# Altium project CYUSB3314.PrjPCB
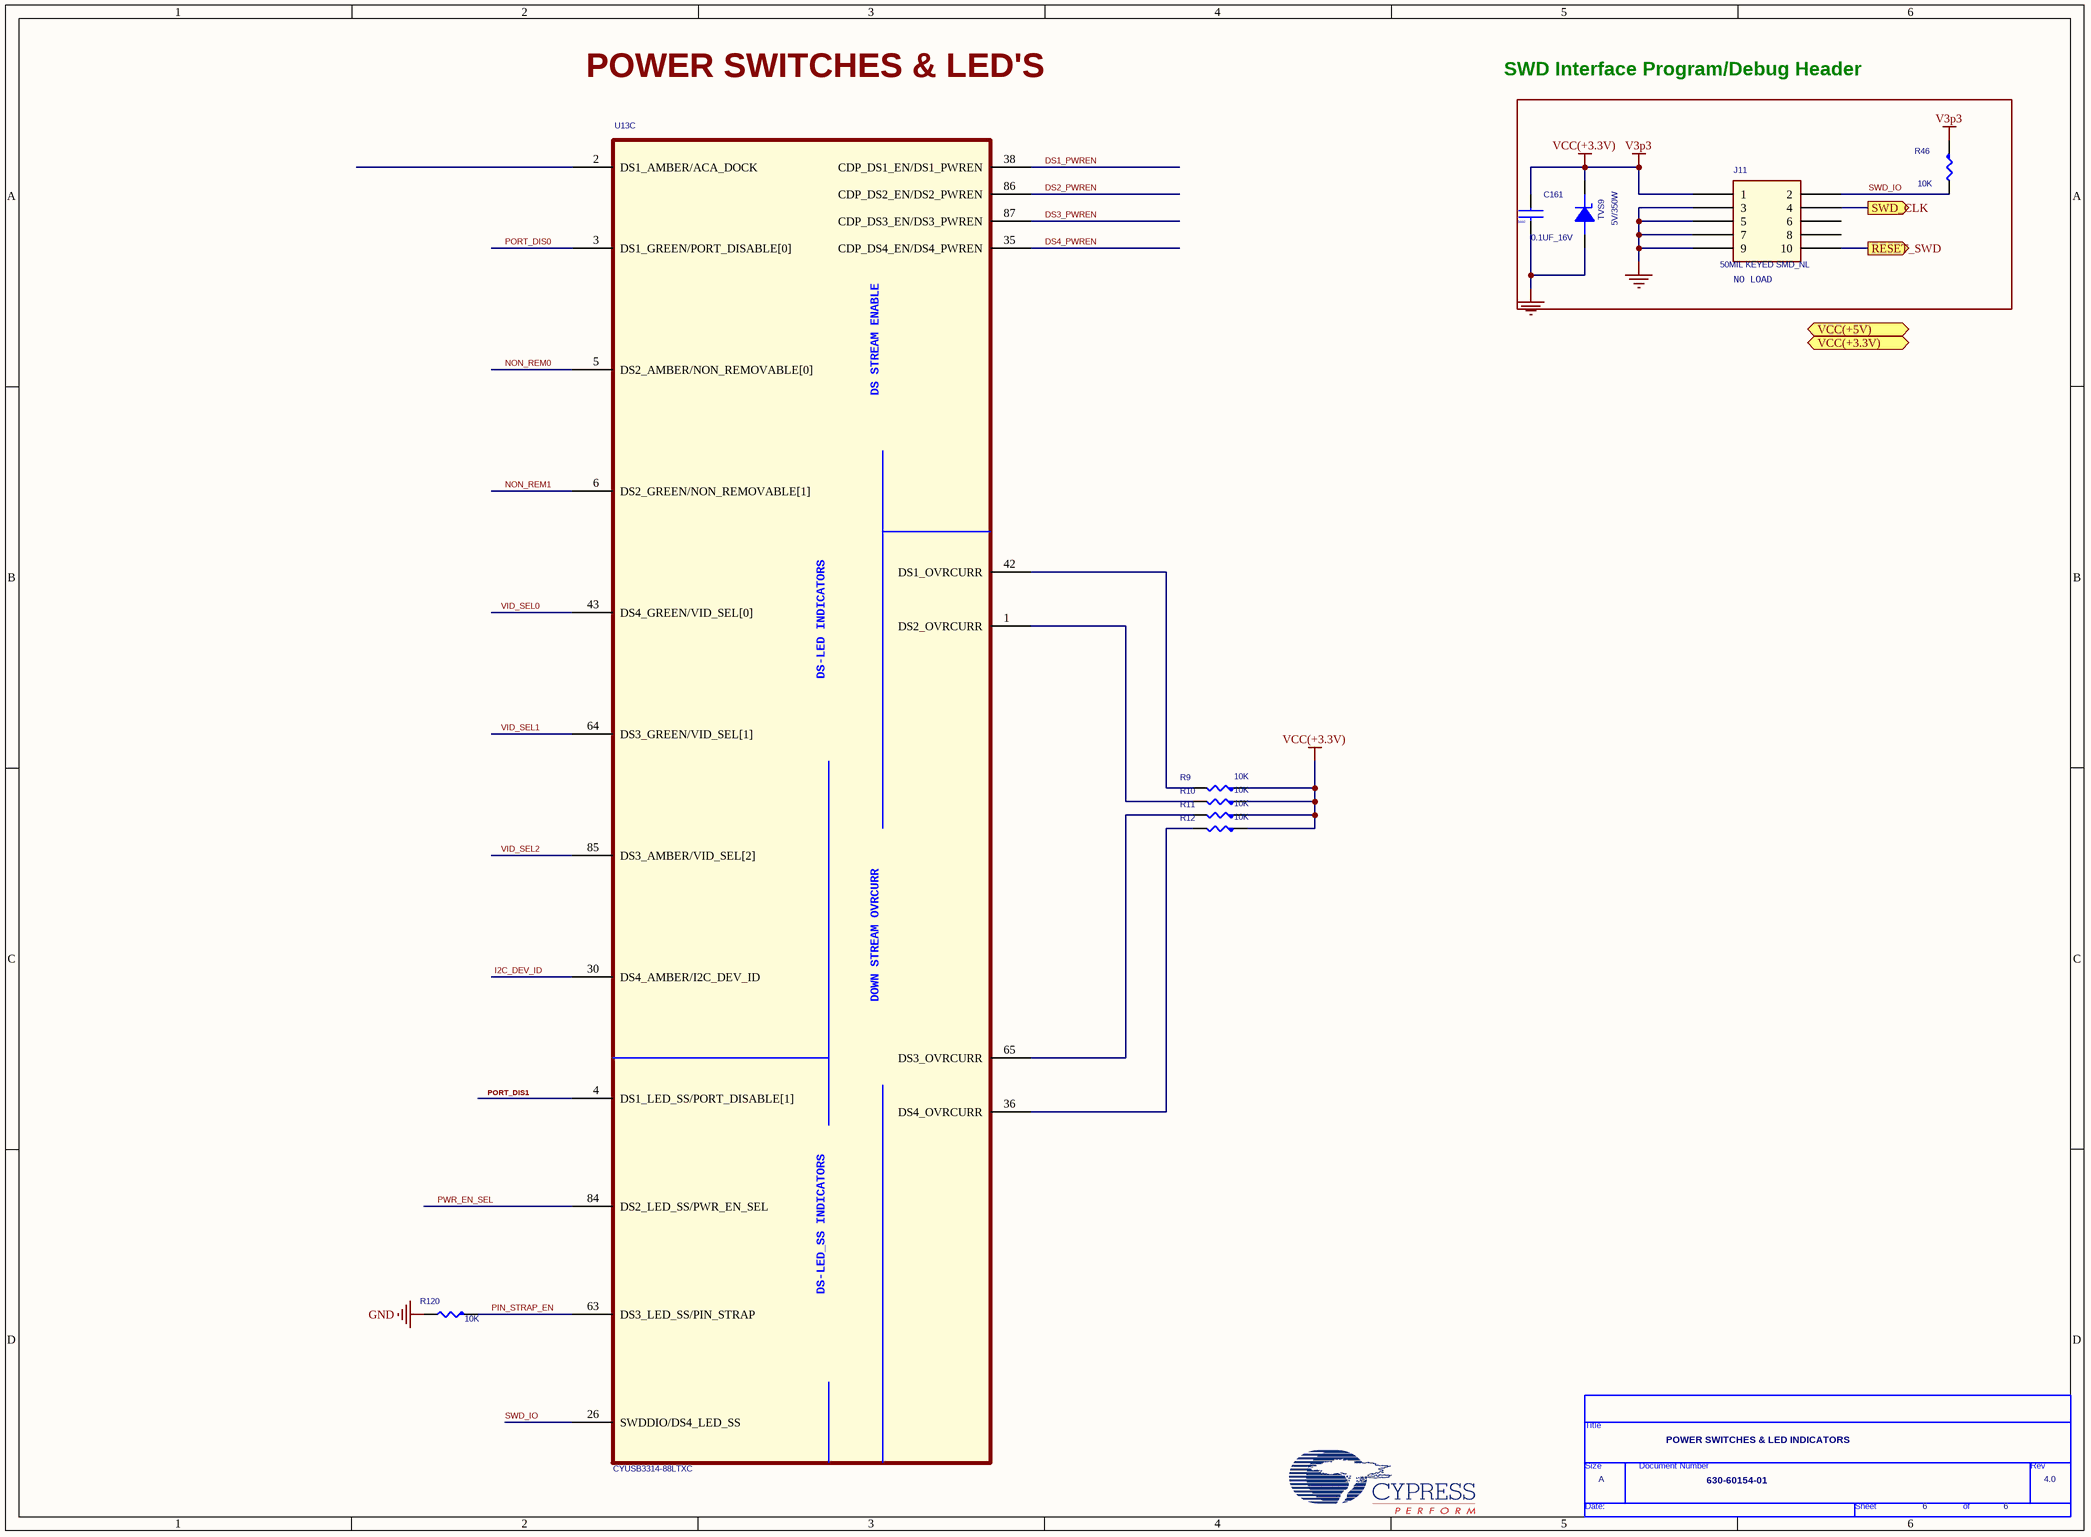
[diagram p0: Cyusb3314_Indicator.SchDoc]
4 sheets, 142 parts. Net scope: global (net labels, ports and power ports of the same name join across sheets).
Board file: CYUSB3314.PcbDoc
Sheets:
  Cyusb3314_Indicator.SchDoc
  Power.SchDoc
  Cyusb3314_Interface.SchDoc
  Cyusb3314_Power.SchDoc

## Sheet Cyusb3314_Indicator.SchDoc
size 391 x 287 mm

### Parts
(Parts that share a designator on the sheet are numbered #1, #2 ... from top to bottom, then left to right.)
*#1  Page Count: 6  Page Size: A  Title: POWER SWITCHES & LED INDICATORS  RevCode: 4.0  Doc: 630-60154-01  (hidden comment: TitleBlock0)  (graphical)
C161  0.1UF_16V  [C0402]
J11  50MIL KEYED SMD_NL  [SAMTEC_FTSH-105-01-L-DV-K]
R9  10K  [0603S-RES]
R10  10K  [0603S-RES]
R11  10K  [0603S-RES]
R12  10K  [0603S-RES]
R46  10K  [0603S-RES]
R120#1  10K  [0603S-RES]
TVS9  5V/350W  [SOD2513X120M]
U13  CYUSB3314-88LTXC  [QFN40P1000X1000X100-89M]  (part C of 3)

### Blocks framed on the sheet
NO LOAD: C161 J11 R46 TVS9

### Ports
RESET_SWD (out), SWD_CLK (out), VCC(+3.3V) (in), VCC(+5V) (in)

### Nets
GND: C161.2 J11.3 J11.5 J11.7 J11.9 R120#1.2 TVS9.2(A)
V3p3: C161.1 J11.1 R9.1 R10.1 R11.1 R12.1 R46.1 TVS9.1(K)  [also labelled VCC(+3.3V)]
DS1_PWREN: U13.38(CDP_DS1_EN/DS1_PWREN)
DS2_PWREN: U13.86(CDP_DS2_EN/DS2_PWREN)
DS3_PWREN: U13.87(CDP_DS3_EN/DS3_PWREN)
DS4_PWREN: U13.35(CDP_DS4_EN/DS4_PWREN)
I2C_DEV_ID: U13.30(DS4_AMBER/I2C_DEV_ID)
NON_REM0: U13.5(DS2_AMBER/NON_REMOVABLE[0])
NON_REM1: U13.6(DS2_GREEN/NON_REMOVABLE[1])
PIN_STRAP_EN: R120#1.1 U13.63(DS3_LED_SS/PIN_STRAP)
PORT_DIS0: U13.3(DS1_GREEN/PORT_DISABLE[0])
PORT_DIS1: U13.4(DS1_LED_SS/PORT_DISABLE[1])
PWR_EN_SEL: U13.84(DS2_LED_SS/PWR_EN_SEL)
SWD_IO: J11.2 R46.2 U13.26(SWDDIO/DS4_LED_SS)
VID_SEL0: U13.43(DS4_GREEN/VID_SEL[0])
VID_SEL1: U13.64(DS3_GREEN/VID_SEL[1])
VID_SEL2: U13.85(DS3_AMBER/VID_SEL[2])
NetC188_1: J11.10 ; port RESET_SWD
NetJ11_4: J11.4 ; port SWD_CLK
NetR9_2: R9.2 U13.42(DS1_OVRCURR)
NetR10_2: R10.2 U13.1(DS2_OVRCURR)
NetR11_2: R11.2 U13.65(DS3_OVRCURR)
NetR12_2: R12.2 U13.36(DS4_OVRCURR)

Not connected (* = marked no-connect by the designer): J11 6 8; U13 2(DS1_AMBER/ACA_DOCK)

### Notes on the sheet
- POWER SWITCHES & LED'S
- SWD Interface Program/Debug Header
- (in symbol 0.1 uFd 0402) 0402
- (in symbol CYUSB3314-88LTXC_2, part C) DS STREAM ENABLE; DS-LED INDICATORS; DOWN STREAM OVRCURR; DS-LED_SS INDICATORS
- (in symbol TitleBlock0) Title; Size; Document Number; Rev; Date:; Sheet; of

### Library data of the parts
C161 = 0.1 uFd 0402: CAP .1UF 16V CERAMIC Y5V 0402; Cy_part#: 730R-10010; Manufacturer: Panasonic - ECG; Part Number: ECJ-0EF1C104Z; DEVICE: 0p1uFd_0402; CLASS: DISCRETE; ALT_SYMBOLS: C-CC0402_A; VOLTAGE: 16V; Created by: SNF
J11 = 10 Pin Header 50mil Keyed SMD: CONN HEADER 10 PIN 50MIL KEYED SMD; Part Number: FTSH-105-01-L-DV-K; Manufacturer: Samtec; Cy_part#: 420R-14312; CLASS: IO; Last Edit By: SNF; DEVICE: HDR5x2x50KS
R9-R12 = R_Dup1: RES 200 OHM 1% 0603 SMD; Manufacturer: Stackpole; Part Number: RNCP0603FTD200R
R46 = R_Dup1: RES 10.0K OHM 1/10W 1% 0603 SMD; Manufacturer: Panasonic - ECG; Part Number: ERJ-3EKF1002V; Lead Free: YES
R120#1 = R_Dup1: Manufacturer: Panasonic; Part Number: ERJ-2RKF49.9X
TVS9 = TVS 5V SOD-323_0: TVS UNIDIR 350W 5V SOD-323; Part Number: SD05.TCT; Manufacturer: Dioded Inc.; CLASS: DISCRETE; DEVICE: SD05-7; LastEditBy: gir
U13 = CYUSB3314-88LTXC_2: Manufacturer: *; Part Number: CYUSB3314-88LTXC
*#1 = TitleBlock0: Page Number: 6; Page Create Date: March  8, 1995

## Sheet Power.SchDoc
size A4
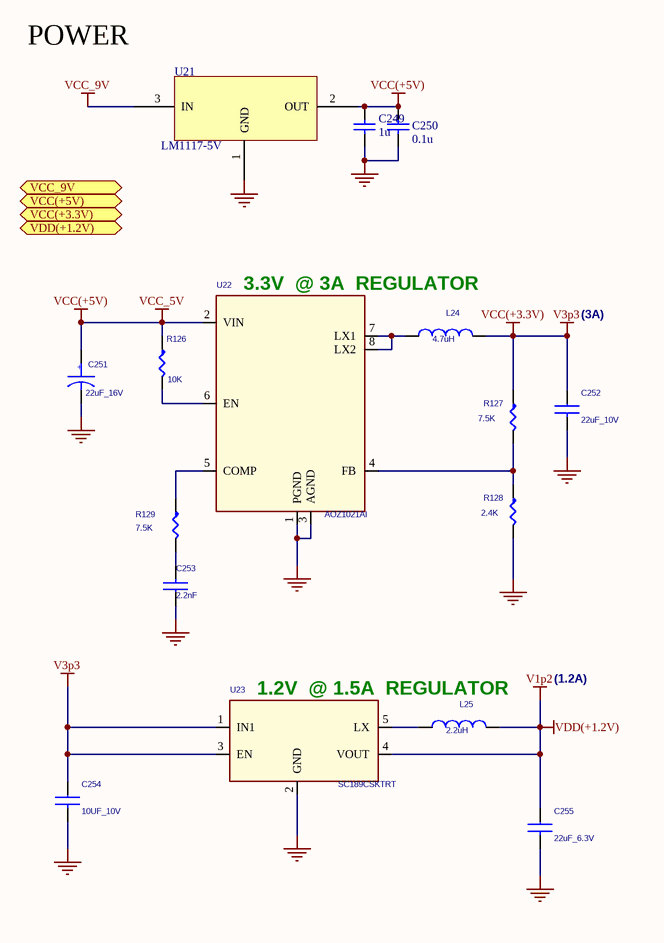
[diagram p1: Power.SchDoc]

### Parts
C249  1u  [C0603]
C250  0.1u  [C0402]
C251  22uF_16V  [C0603]
C252  22uF_10V  [C0603]
C253  2.2nF  [C0603]
C254  10UF_10V  [C0603]
C255  22uF_6.3V  [C0603]
L24  4.7uH  [L0603]
L25  2.2uH  [L0603]
R126  10K  [0603S-RES]
R127  7.5K  [0603S-RES]
R128  2.4K  [0603S-RES]
R129  7.5K  [0603S-RES]
U21  LM1117-5V  [SOT-223]
U22  AOZ1021AI  [SOIC127P600X175-8M]
U23  SC189CSKTRT  [SOT95P280X145-5M]

### Ports
VCC(+3.3V) (bidir), VCC(+5V) (bidir), VCC_9V (in), VDD(+1.2V) (bidir)

### Nets
GND: C249.1 C250.2 C251.2 C252.2 C253.1 C254.2 C255.2 R128.2 U21.1(GND) U22.1(PGND) U22.3(AGND) U23.2(GND)
V1p2: C255.1 L25.2 U23.4(VOUT)  [also labelled VDD(+1.2V)]  [project net DVDD12]
V3p3: C252.1 C254.1 L24.2 R127.1 U23.1(IN1) U23.3(EN)  [also labelled VCC(+3.3V)]
VCC(+5V): C249.2 C250.1 C251.1 R126.1 U21.2(OUT) U22.2(VIN)  [also labelled VCC_5V]
VCC_9V: U21.3(IN)
NetC253_2: C253.2 R129.2
NetL24_1: L24.1 U22.7(LX1) U22.8(LX2)
NetL25_1: L25.1 U23.5(LX)
NetR126_2: R126.2 U22.6(EN)
NetR127_2: R127.2 R128.1 U22.4(FB)
NetR129_1: R129.1 U22.5(COMP)

### Notes on the sheet
- POWER
- 3.3V  @ 3A  REGULATOR
- (3A)
- 1.2V  @ 1.5A  REGULATOR
- (1.2A)
- (in symbol CAP POL) +

### Library data of the parts
C249 = Cap: 50V/8.2u/0805; Value: 100n; Published: 8-Jun-2000; LatestRevisionDate: 17-Jul-2002; LatestRevisionNote: Re-released for DXP Platform.; PackageReference: RAD-0.3; Publisher: Altium Limited
C250 = CAP0805: Capacitor; Value: 104; Published: 8-Jun-2000; Revision: July-2002: Re-released for DXP Platform.; Publisher: Altium Limited
C251 = CAP POL: CAP TANT 22UF 16V 10% 1206; Manufacturer: Nichicon; Part Number: F951C226KQAAQ2; RoHS Compliant: Yes; Lead Free Status: No
C252 C254 C255 = CAPACITOR NON-POL: Manufacturer: *; Part Number: *
C253 = CAPACITOR NON-POL: CAP CER 2200PF 50V 10% X7R 0805; Manufacturer: Yageo; Part Number: CC0805KRX7R9BB222; Num Pins: 2; RoHS Compliant: Yes; Lead Free: YES
L24 = INDUCTOR: INDUCTOR 4.7UH 2.7A 20% SMD; Part Number: NR6028T4R7M; Manufacturer: Taiyo Yuden; Lead Free: YES
L25 = INDUCTOR: INDUCTOR 2.2UH 1.20A 20% 1210; Part Number: NLCV32T-2R2M-PFR; Manufacturer: TDK Corporation; Lead Free: YES
R126 = R_Dup1: as R46 on sheet Cyusb3314_Indicator; Lead Free: YES
R127 = R_Dup1: RES 7.5K OHM 1/10W 1% 0603 SMD; Manufacturer: Panasonic - ECG; Part Number: ERJ-3EKF7501V; Lead Free: YES
R128 = R_Dup1: RES 2.4K OHM 1/10W 1% 0603 SMD; Manufacturer: Panasonic - ECG; Part Number: ERJ-3EKF2401V; Lead Free: YES
R129 = R_Dup1: RES 7.5K OHM 1/10W 1% 0603 SMD; Part Number: ERJ-3EKF7501V; Manufacturer: Panasonic - ECG; Lead Free: YES
U21 = AMS1117
U22 = AOZ1021AI: IC REG BUCK SYNC ADJ 3A 8SOIC; Manufacturer: Alpha & Omega Semiconductor Inc; Part Number: AOZ1021AI
U23 = SC189CSKTRT: IC REG BUCK SYNC 1.2V SOT23-5; Manufacturer: Semtech; Part Number: SC189CSKTRT

## Sheet Cyusb3314_Interface.SchDoc
size 401 x 330 mm
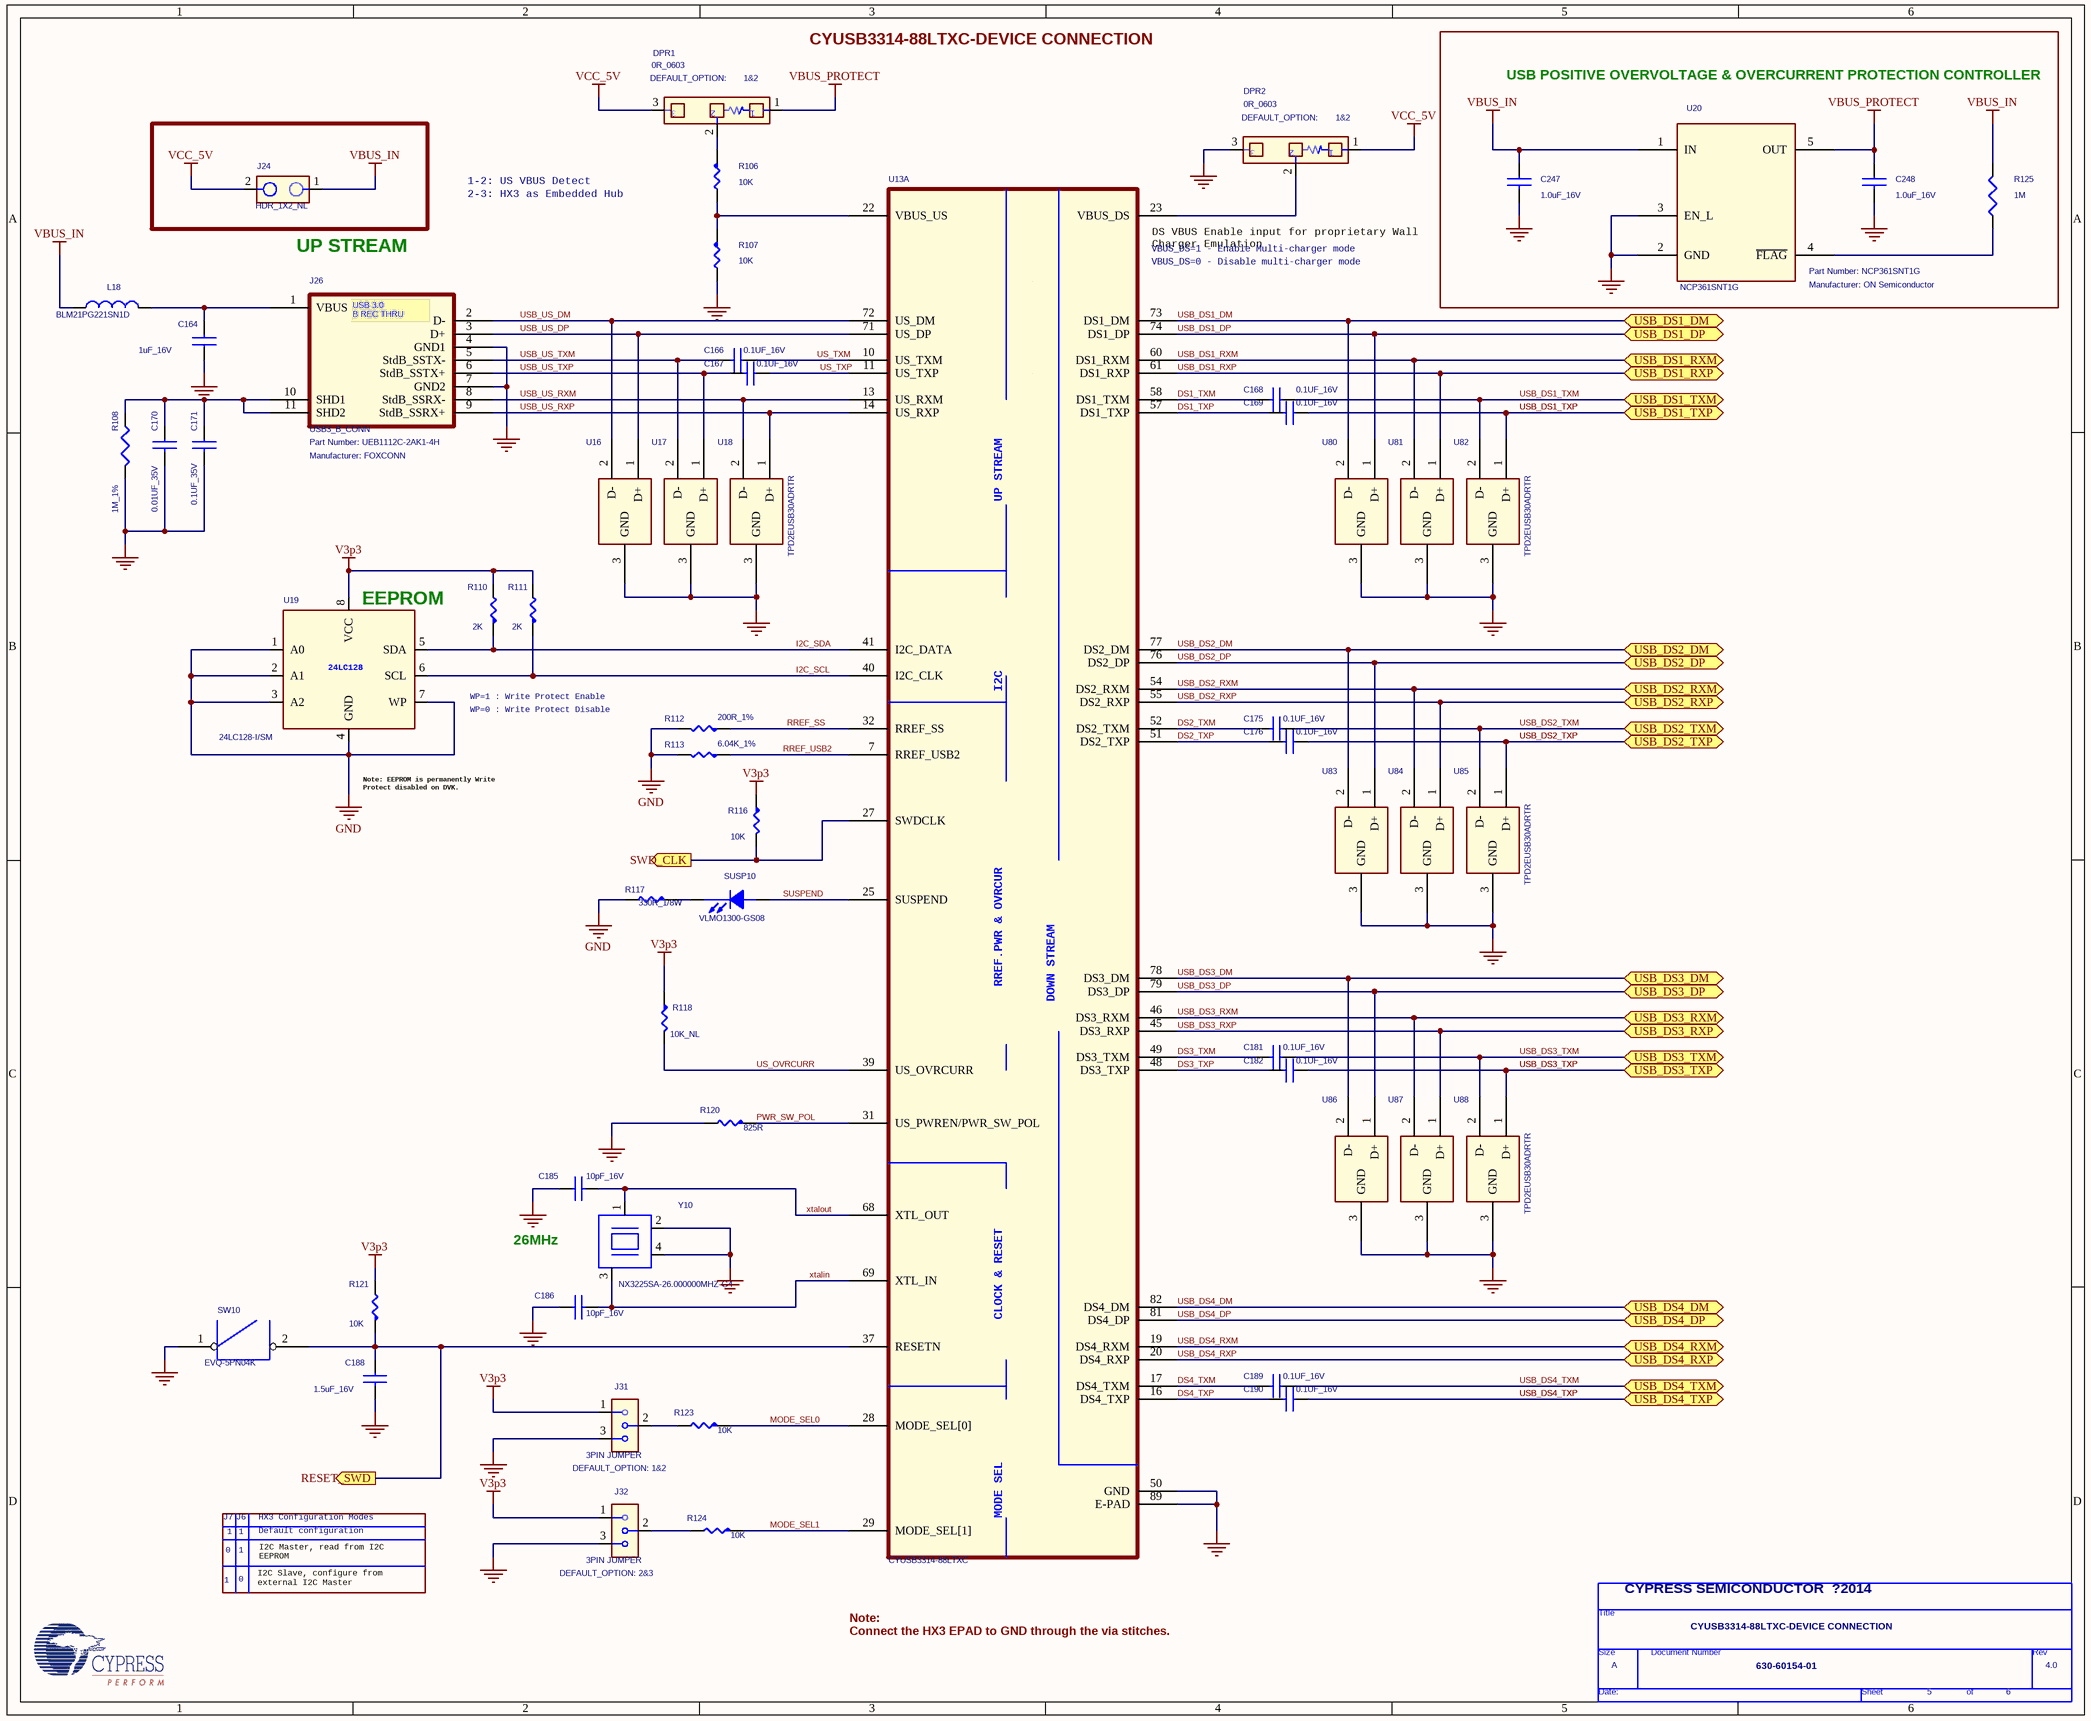
[diagram p2: Cyusb3314_Interface.SchDoc]

### Parts
(Parts that share a designator on the sheet are numbered #1, #2 ... from top to bottom, then left to right.)
*#2  Page Count: 6  Page Number: 5  Page Size: A  Title: CYUSB3314-88LTXC-DEVICE CONNECTION  RevCode: 4.0  Doc: 630-60154-01  (hidden comment: TitleBlock0)  (graphical)
C164  1uF_16V  [C0603]
C166  0.1UF_16V  [C0402]
C167  0.1UF_16V  [C0402]
C168  0.1UF_16V  [C0402]
C169  0.1UF_16V  [C0402]
C170  0.01UF_35V  [C0402]
C171  0.1UF_35V  [C0402]
C175  0.1UF_16V  [C0402]
C176  0.1UF_16V  [C0402]
C181  0.1UF_16V  [C0402]
C182  0.1UF_16V  [C0402]
C185  10pF_16V  [C0603]
C186  10pF_16V  [C0603]
C188  1.5uF_16V  [C0603]
C189  0.1UF_16V  [C0402]
C190  0.1UF_16V  [C0402]
C247  1.0uF_16V  [C0603]
C248  1.0uF_16V  [C0603]
DPR1  0R_0603  Mounting Status: 1&2  [RC0603_3P]
DPR2  0R_0603  Mounting Status: 1&2  [RC0603_3P]
J24  HDR_1X2_NL  [SAMTEC_TSW-102-08-G-S]
J26  USB3_B_CONN  Manufacturer: FOXCONN  [FOXCONN_UEB1112C-2AK1-4H]
J31  3PIN JUMPER  DEFAULT_OPTION: 1&2  [TE_3-644456-3]
J32  3PIN JUMPER  DEFAULT_OPTION: 2&3  [TE_3-644456-3]
L18  BLM21PG221SN1D  [L0603]
R106  10K  [0603S-RES]
R107  10K  [0603S-RES]
R108  1M_1%  [0603S-RES]
R110  2K  [0603S-RES]
R111  2K  [0603S-RES]
R112  200R_1%  [0603S-RES]
R113  6.04K_1%  [0603S-RES]
R116  10K  [0603S-RES]
R117  330R_1/8W  [0603S-RES]
R118  10K_NL  [0603S-RES]
R120#2  825R  [0603S-RES]
R121  10K  [0603S-RES]
R123  10K  [0603S-RES]
R124  10K  [0603S-RES]
R125  1M  [0603S-RES]
SUSP10  VLMO1300-GS08  [LED0805S]
SW10  EVQ-5PN04K  [157SW]
U13  CYUSB3314-88LTXC  [QFN40P1000X1000X100-89M]  (part A of 3)
U16  TPD2EUSB30ADRTR  [SOTFL35P100X50-3M]  (value not drawn)
U17  TPD2EUSB30ADRTR  [SOTFL35P100X50-3M]  (value not drawn)
U18  TPD2EUSB30ADRTR  [SOTFL35P100X50-3M]
U19  24LC128-I/SM  [SOIC127P790X203-8M]
U20  NCP361SNT1G  Manufacturer: ON Semiconductor  [SOP95P275X110-5M]
U80  TPD2EUSB30ADRTR  [SOTFL35P100X50-3M]  (value not drawn)
U81  TPD2EUSB30ADRTR  [SOTFL35P100X50-3M]  (value not drawn)
U82  TPD2EUSB30ADRTR  [SOTFL35P100X50-3M]
U83  TPD2EUSB30ADRTR  [SOTFL35P100X50-3M]  (value not drawn)
U84  TPD2EUSB30ADRTR  [SOTFL35P100X50-3M]  (value not drawn)
U85  TPD2EUSB30ADRTR  [SOTFL35P100X50-3M]
U86  TPD2EUSB30ADRTR  [SOTFL35P100X50-3M]  (value not drawn)
U87  TPD2EUSB30ADRTR  [SOTFL35P100X50-3M]  (value not drawn)
U88  TPD2EUSB30ADRTR  [SOTFL35P100X50-3M]
Y10  NX3225SA-26.000000MHZ-G4  [爱普生晶振3.2×2.5MM - 无源]

### Blocks framed on the sheet
USB POSITIVE OVERVOLTAGE & OVERCURRENT PROTECTION CONTROLLER: C247 C248 R125 U20

### Ports
RESET_SWD (out), SWD_CLK (out), USB_DS1_DM (bidir), USB_DS1_DP (bidir), USB_DS1_RXM (bidir), USB_DS1_RXP (bidir), USB_DS1_TXM (bidir), USB_DS1_TXP (bidir), USB_DS2_DM (bidir), USB_DS2_DP (bidir), USB_DS2_RXM (bidir), USB_DS2_RXP (bidir), USB_DS2_TXM (bidir), USB_DS2_TXP (bidir), USB_DS3_DM (bidir), USB_DS3_DP (bidir), USB_DS3_RXM (bidir), USB_DS3_RXP (bidir), USB_DS3_TXM (bidir), USB_DS3_TXP (bidir), USB_DS4_DM (bidir), USB_DS4_DP (bidir), USB_DS4_RXM (bidir), USB_DS4_RXP (bidir), USB_DS4_TXM (bidir), USB_DS4_TXP (bidir)

### Nets
GND: C164.1 C170.2 C171.2 C185.1 C186.1 C188.2 C247.2 C248.2 DPR2.3 J26.4(GND1) J26.7(GND2) J31.3 J32.3 R107.2 R108.2 R112.2 R113.2 R117.2 R120#2.2 SW10.1 U13.50(GND) U13.89(E-PAD) U16.3(GND) U17.3(GND) U18.3(GND) U19.1(A0) U19.2(A1) U19.3(A2) U19.4(GND) U19.7(WP) U20.2(GND) U20.3(EN_L) U80.3(GND) U81.3(GND) U82.3(GND) U83.3(GND) U84.3(GND) U85.3(GND) U86.3(GND) U87.3(GND) U88.3(GND) Y10.2 Y10.4
V3p3: J31.1 J32.1 R110.2 R111.2 R116.1 R118.1 R121.2 U19.8(VCC)
VBUS_IN: C247.1 J24.1 L18.1 R125.2 U20.1(IN)
VBUS_PROTECT: C248.1 DPR1.1 U20.5(OUT)
VCC_5V: DPR1.3 DPR2.1 J24.2  [project net VCC(+5V)]
DS1_TXM: C168.2 U13.58(DS1_TXM)
DS1_TXP: C169.2 U13.57(DS1_TXP)
DS2_TXM: C175.2 U13.52(DS2_TXM)
DS2_TXP: C176.2 U13.51(DS2_TXP)
DS3_TXM: C181.2 U13.49(DS3_TXM)
DS3_TXP: C182.2 U13.48(DS3_TXP)
DS4_TXM: C189.2 U13.17(DS4_TXM)
DS4_TXP: C190.2 U13.16(DS4_TXP)
I2C_SCL: R111.1 U13.40(I2C_CLK) U19.6(SCL)
I2C_SDA: R110.1 U13.41(I2C_DATA) U19.5(SDA)
MODE_SEL0: R123.1 U13.28(MODE_SEL[0])
MODE_SEL1: R124.1 U13.29(MODE_SEL[1])
PWR_SW_POL: R120#2.1 U13.31(US_PWREN/PWR_SW_POL)
RREF_SS: R112.1 U13.32(RREF_SS)
RREF_USB2: R113.1 U13.7(RREF_USB2)
SUSPEND: SUSP10.1(ANODE) U13.25(SUSPEND)
US_OVRCURR: R118.2 U13.39(US_OVRCURR)
US_TXM: C166.1 U13.10(US_TXM)
US_TXP: C167.1 U13.11(US_TXP)
USB_DS1_DM: U13.73(DS1_DM) U80.2(D-) ; port USB_DS1_DM
USB_DS1_DP: U13.74(DS1_DP) U80.1(D+) ; port USB_DS1_DP
USB_DS1_RXM: U13.60(DS1_RXM) U81.2(D-) ; port USB_DS1_RXM
USB_DS1_RXP: U13.61(DS1_RXP) U81.1(D+) ; port USB_DS1_RXP
USB_DS1_TXM: C168.1 U82.2(D-) ; port USB_DS1_TXM
USB_DS1_TXP: C169.1 U82.1(D+) ; port USB_DS1_TXP
USB_DS2_DM: U13.77(DS2_DM) U83.2(D-) ; port USB_DS2_DM
USB_DS2_DP: U13.76(DS2_DP) U83.1(D+) ; port USB_DS2_DP
USB_DS2_RXM: U13.54(DS2_RXM) U84.2(D-) ; port USB_DS2_RXM
USB_DS2_RXP: U13.55(DS2_RXP) U84.1(D+) ; port USB_DS2_RXP
USB_DS2_TXM: C175.1 U85.2(D-) ; port USB_DS2_TXM
USB_DS2_TXP: C176.1 U85.1(D+) ; port USB_DS2_TXP
USB_DS3_DM: U13.78(DS3_DM) U86.2(D-) ; port USB_DS3_DM
USB_DS3_DP: U13.79(DS3_DP) U86.1(D+) ; port USB_DS3_DP
USB_DS3_RXM: U13.46(DS3_RXM) U87.2(D-) ; port USB_DS3_RXM
USB_DS3_RXP: U13.45(DS3_RXP) U87.1(D+) ; port USB_DS3_RXP
USB_DS3_TXM: C181.1 U88.2(D-) ; port USB_DS3_TXM
USB_DS3_TXP: C182.1 U88.1(D+) ; port USB_DS3_TXP
USB_DS4_DM: U13.82(DS4_DM) ; port USB_DS4_DM
USB_DS4_DP: U13.81(DS4_DP) ; port USB_DS4_DP
USB_DS4_RXM: U13.19(DS4_RXM) ; port USB_DS4_RXM
USB_DS4_RXP: U13.20(DS4_RXP) ; port USB_DS4_RXP
USB_DS4_TXM: C189.1 ; port USB_DS4_TXM
USB_DS4_TXP: C190.1 ; port USB_DS4_TXP
USB_US_DM: J26.2(D-) U13.72(US_DM) U16.2(D-)
USB_US_DP: J26.3(D+) U13.71(US_DP) U16.1(D+)
USB_US_RXM: J26.8(StdB_SSRX-) U13.13(US_RXM) U18.2(D-)
USB_US_RXP: J26.9(StdB_SSRX+) U13.14(US_RXP) U18.1(D+)
USB_US_TXM: C166.2 J26.5(StdB_SSTX-) U17.2(D-)
USB_US_TXP: C167.2 J26.6(StdB_SSTX+) U17.1(D+)
xtalin: C186.2 U13.69(XTL_IN) Y10.3
xtalout: C185.2 U13.68(XTL_OUT) Y10.1
NetC164_2: C164.2 J26.1(VBUS) L18.2
NetC170_1: C170.1 C171.1 J26.10(SHD1) J26.11(SHD2) R108.1
NetC188_1: C188.1 R121.1 SW10.2 U13.37(RESETN) ; port RESET_SWD
NetDPR1_2: DPR1.2 R106.1
NetDPR2_2: DPR2.2 U13.23(VBUS_DS)
NetJ11_4: R116.2 U13.27(SWDCLK) ; port SWD_CLK
NetJ31_2: J31.2 R123.2
NetJ32_2: J32.2 R124.2
NetR106_2: R106.2 R107.1 U13.22(VBUS_US)
NetR117_1: R117.1 SUSP10.2(CATHODE)
NetR125_1: R125.1 U20.4(~{FLAG})

### Notes on the sheet
- CYUSB3314-88LTXC-DEVICE CONNECTION
- 1-2: US VBUS Detect
- 2-3: HX3 as Embedded Hub
- UP STREAM
- (near U13) DS VBUS Enable input for proprietary Wall
  Charger Emulation
- (near U13) VBUS_DS=0 - Disable multi-charger mode
- (near U13) VBUS_DS=1 - Enable Multi-charger mode
- (near U19) EEPROM
- WP=1 : Write Protect Enable
- WP=0 : Write Protect Disable
- (near U19) Note: EEPROM is permanently Write
  Protect disabled on DVK.
- 26MHz
- J7
- 1
- J6
- HX3 Configuration Modes
- Default configuration
- 0
- I2C Slave, configure from
  external I2C Master
- I2C Master, read from I2C
  EEPROM
- (near *#2) CYPRESS SEMICONDUCTOR  ?2014
- Note:
  Connect the HX3 EPAD to GND through the via stitches.
- (in symbol CYUSB3314-88LTXC_2, part A) UP STREAM; I2C; RREF.PWR & OVRCUR; DOWN STREAM; CLOCK & RESET; MODE SEL
- (in symbol TitleBlock0) Title; Size; Document Number; Rev; Date:; Sheet; of
- (in symbol UEB1112C-2AK1-4H) USB 3.0 / B REC THRU

### Library data of the parts
C164 C166-C169 C175 C176 C181 C182 C185 C186 C189 C190 = CAPACITOR NON-POL
  C164 C175 C176 C189 C190: Manufacturer: *; Part Number: *
  C181: Manufacturer: *
C170 = CAPACITOR NON-POL: Part Number: C1005X7R1V103M050BB; Manufacturer: *
C171 = CAPACITOR NON-POL: Part Number: C1005X7R1V104K050BB
C188 = CAPACITOR NON-POL: CAP CER 1.5UF 10V 10% X7R 0805; Manufacturer: TDK Corporation; Lead Free: YES
C247 C248 = CAP: CAP - CER, 1uF, 10V, +/-10%, X5R, 0402; Part Class: CAPACITORS; Num Pins: 2; Item Num: P03-15479R; RoHS Compliant: Yes; Lead Free Status: Yes
DPR1 DPR2 = DPR12_0: Resistor, 4.7K, 0402, 1/10W, 5%; Part Number: ERJ-2GEJ472X
J24 = HEADER_1x2: Manufacturer: Samtec Inc; Part Number: TSW-102-08-G-S; Lead Free: YES
J26 = UEB1112C-2AK1-4H: USB 3.0 B Series Right Angle,T/H 9 Pos; Lead Free: YES; Part Number: UEB1112C-2AK1-4H
J31 J32 = 3PIN JUM: CONN HEADER VERT 3POS .100 TIN; Part Number: 3-644456-3; Manufacturer: Tyco Electronics; Type: Single Row,3Pin Header
L18 = INDUCTOR: FERRITE CHIP 220 OHM 2A 0805; Manufacturer: Murata; Lead Free: YES; Part Number: BLM21PG221SN1D
R106 = R_Dup1: Manufacturer: Panasonic; Part Number: ERJ-2GE0R00X
R107 = R_Dup1: Part Number: ERJ-2RKF4990X; Manufacturer: Panasonic
R108 = R: RES 1M OHM 1/10W 1% 0603 SMD; Part Number: ERJ-3EKF1004V; Manufacturer: Panasonic
R110 = R_Dup1: RES 2.00K OHM 1/10W 1% 0603 SMD; Manufacturer: Rohm Semiconductor; Part Number: MCR03EZPFX2001; Lead Free: YES
R111 = R_Dup1: RES 2.00K OHM 1/10W 1% 0603 SMD; Part Number: MCR03EZPFX2001; Manufacturer: Rohm Semiconductor; Lead Free: YES
R112 = R_Dup1: as R9 on sheet Cyusb3314_Indicator
R113 = R_Dup1: RES 6.04K OHM .25W 1% 0603 SMD; Part Number: CRCW06036K04FKEAHP; Manufacturer: Vishay Dale
R116 = R_Dup1: as R46 on sheet Cyusb3314_Indicator; Lead Free: YES
R117 = R_Dup1: Lead Free: YES
R118 = R_Dup1: RES 10.0K OHM 1/10W 1% 0603 SMD; Part Number: ERJ-3EKF1002V; Manufacturer: Panasonic - ECG; Lead Free: YES
R120#2 R123 R124 = R_Dup1: as R120#1 on sheet Cyusb3314_Indicator
R121 = R_Dup1: Part Number: ERJ-2RKF49.9X; Manufacturer: Panasonic
R125 = R: RES 1.00M OHM 1/10W 1% 0402 SMD; Manufacturer: Panasonic; Part Number: ERJ-2RKF1004X
SUSP10 = LED: Part Number: VLMO1300-GS08
SW10 = B3U1000P: Part Number: EVQ-5PN04K
U13 = CYUSB3314-88LTXC_2: Part Number: CYUSB3314-88LTXC
U19 = 24LC128: IC EEPROM 128KBIT 400KHZ 8SOIC; Manufacturer: Microchip Technology; Lead Free: YES; Part Number: 24LC128-I/SM
U20 = NCP361SNT1G_0: IC USB POS OVP/OC_TSOP5; Part Number: NCP361SNT1G
Y10 = CRYSTAL_1: Manufacturer: NDK; Part Number: NX3225SA-26.000000MHZ-G4
*#2 = TitleBlock0: Page Create Date: March  8, 1995
U16-U18 U80-U88 = TPD2EUSB30ADRTR: Part Number: TPD2EUSB30ADRTR

## Sheet Cyusb3314_Power.SchDoc
size 386 x 284 mm
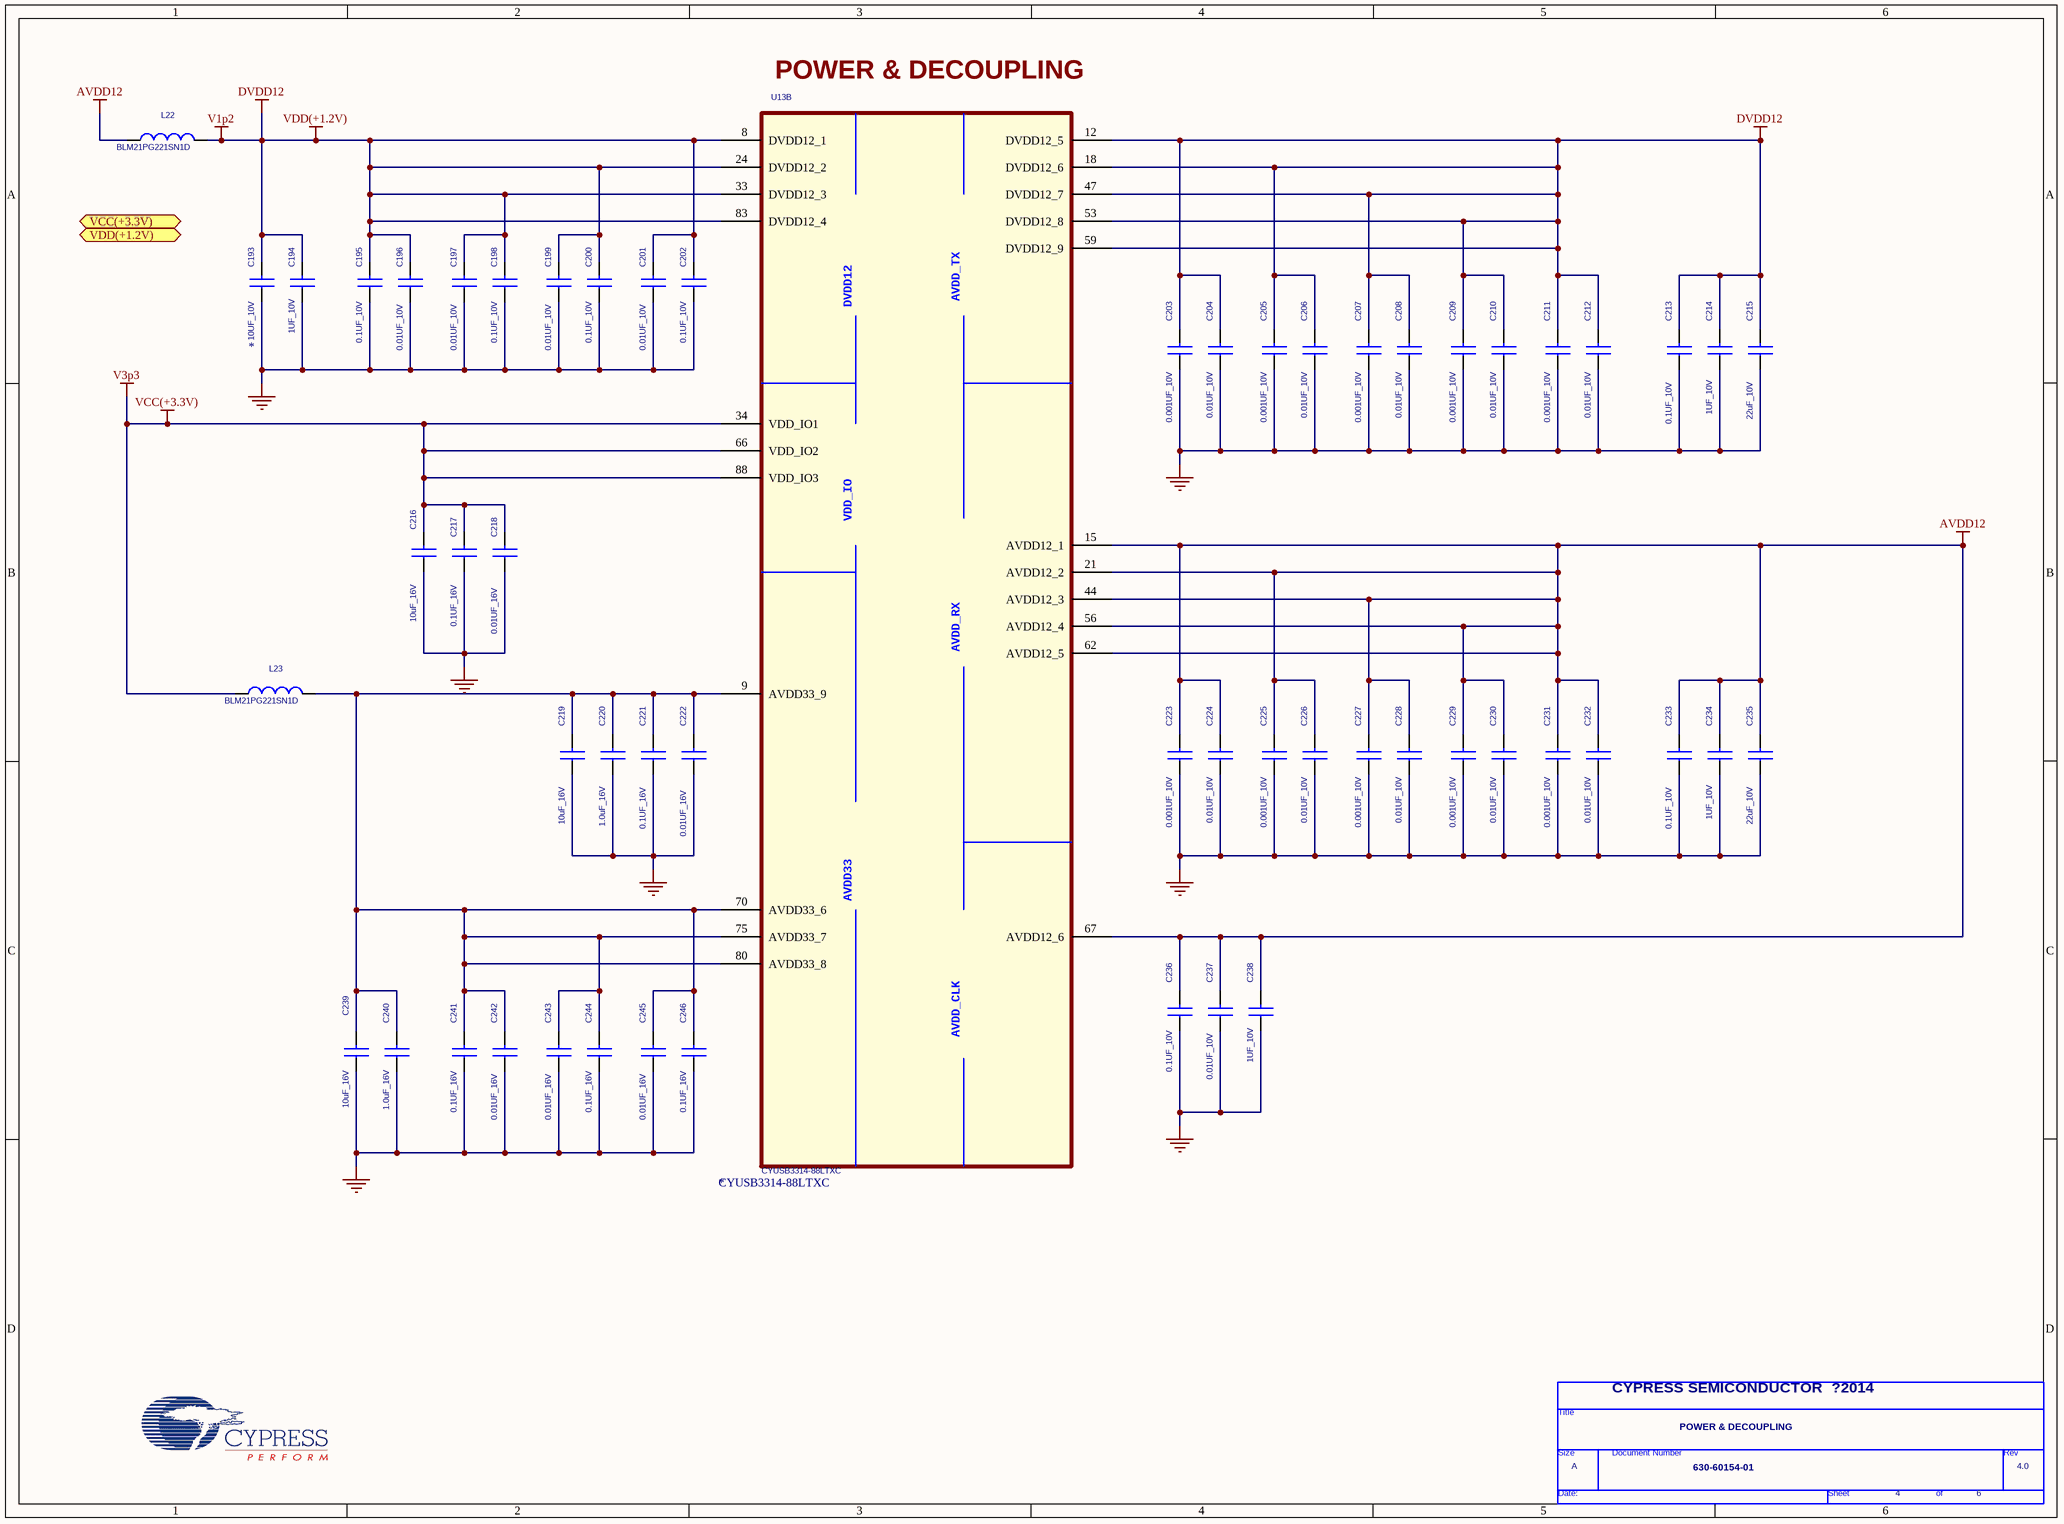
[diagram p3: Cyusb3314_Power.SchDoc]

### Parts
(Parts that share a designator on the sheet are numbered #1, #2 ... from top to bottom, then left to right.)
*#3  Page Count: 6  Page Number: 4  Page Size: A  Title: POWER & DECOUPLING  RevCode: 4.0  Doc: 630-60154-01  (hidden comment: TitleBlock0)  (graphical)
C193  10UF_10V  [C0603]
C194  1UF_10V  [C0603]
C195  0.1UF_10V  [C0402]
C196  0.01UF_10V  [C0402]
C197  0.01UF_10V  [C0402]
C198  0.1UF_10V  [C0402]
C199  0.01UF_10V  [C0402]
C200  0.1UF_10V  [C0402]
C201  0.01UF_10V  [C0402]
C202  0.1UF_10V  [C0402]
C203  0.001UF_10V  [C0402]
C204  0.01UF_10V  [C0402]
C205  0.001UF_10V  [C0402]
C206  0.01UF_10V  [C0402]
C207  0.001UF_10V  [C0402]
C208  0.01UF_10V  [C0402]
C209  0.001UF_10V  [C0402]
C210  0.01UF_10V  [C0402]
C211  0.001UF_10V  [C0402]
C212  0.01UF_10V  [C0402]
C213  0.1UF_10V  [C0402]
C214  1UF_10V  [C0603]
C215  22uF_10V  [C0603]
C216  10uF_16V  [C0603]
C217  0.1UF_16V  [C0402]
C218  0.01UF_16V  [C0402]
C219  10uF_16V  [C0603]
C220  1.0uF_16V  [C0603]
C221  0.1UF_16V  [C0402]
C222  0.01UF_16V  [C0402]
C223  0.001UF_10V  [C0402]
C224  0.01UF_10V  [C0402]
C225  0.001UF_10V  [C0402]
C226  0.01UF_10V  [C0402]
C227  0.001UF_10V  [C0402]
C228  0.01UF_10V  [C0402]
C229  0.001UF_10V  [C0402]
C230  0.01UF_10V  [C0402]
C231  0.001UF_10V  [C0402]
C232  0.01UF_10V  [C0402]
C233  0.1UF_10V  [C0402]
C234  1UF_10V  [C0603]
C235  22uF_10V  [C0603]
C236  0.1UF_10V  [C0402]
C237  0.01UF_10V  [C0402]
C238  1UF_10V  [C0603]
C239  10uF_16V  [C0603]
C240  1.0uF_16V  [C0603]
C241  0.1UF_16V  [C0402]
C242  0.01UF_16V  [C0402]
C243  0.01UF_16V  [C0402]
C244  0.1UF_16V  [C0402]
C245  0.01UF_16V  [C0402]
C246  0.1UF_16V  [C0402]
L22  BLM21PG221SN1D  [L0603]
L23  BLM21PG221SN1D  [L0603]
U13  CYUSB3314-88LTXC  [QFN40P1000X1000X100-89M]  (part B of 3)

### Ports
VCC(+3.3V) (in), VDD(+1.2V) (in)

### Nets
AVDD12: C223.2 C224.2 C225.2 C226.2 C227.2 C228.2 C229.2 C230.2 C231.2 C232.2 C233.2 C234.2 C235.2 C236.2 C237.2 C238.2 L22.1 U13.15(AVDD12_1) U13.21(AVDD12_2) U13.44(AVDD12_3) U13.56(AVDD12_4) U13.62(AVDD12_5) U13.67(AVDD12_6)
DVDD12: C193.2 C194.2 C195.2 C196.2 C197.2 C198.2 C199.2 C200.2 C201.2 C202.2 C203.2 C204.2 C205.2 C206.2 C207.2 C208.2 C209.2 C210.2 C211.2 C212.2 C213.2 C214.2 C215.2 L22.2 U13.8(DVDD12_1) U13.12(DVDD12_5) U13.18(DVDD12_6) U13.24(DVDD12_2) U13.33(DVDD12_3) U13.47(DVDD12_7) U13.53(DVDD12_8) U13.59(DVDD12_9) U13.83(DVDD12_4)  [also labelled V1p2, VDD(+1.2V)]
GND: C193.1 C194.1 C195.1 C196.1 C197.1 C198.1 C199.1 C200.1 C201.1 C202.1 C203.1 C204.1 C205.1 C206.1 C207.1 C208.1 C209.1 C210.1 C211.1 C212.1 C213.1 C214.1 C215.1 C216.1 C217.1 C218.1 C219.1 C220.1 C221.1 C222.1 C223.1 C224.1 C225.1 C226.1 C227.1 C228.1 C229.1 C230.1 C231.1 C232.1 C233.1 C234.1 C235.1 C236.1 C237.1 C238.1 C239.1 C240.1 C241.1 C242.1 C243.1 C244.1 C245.1 C246.1
V3p3: C216.2 C217.2 C218.2 L23.1 U13.34(VDD_IO1) U13.66(VDD_IO2) U13.88(VDD_IO3)  [also labelled VCC(+3.3V)]
NetC219_2: C219.2 C220.2 C221.2 C222.2 C239.2 C240.2 C241.2 C242.2 C243.2 C244.2 C245.2 C246.2 L23.2 U13.9(AVDD33_9) U13.70(AVDD33_6) U13.75(AVDD33_7) U13.80(AVDD33_8)

### Notes on the sheet
- POWER & DECOUPLING
- CYPRESS SEMICONDUCTOR  ?2014
- (in symbol CYUSB3314-88LTXC_2, part B) AVDD_TX; DVDD12; VDD_IO; AVDD_RX; AVDD33; AVDD_CLK
- (in symbol TitleBlock0) Title; Size; Document Number; Rev; Date:; Sheet; of

### Library data of the parts
C193-C246 = CAPACITOR NON-POL: Manufacturer: *; Part Number: *
  C196: Decription: *
L22 L23 = INDUCTOR: FERRITE CHIP 220 OHM 2A 0805; Manufacturer: Murata; DEVICE: L4; Part Number: BLM21PG221SN1D; Lead Free: YES
U13 = CYUSB3314-88LTXC_2: Manufacturer: *; Part Number: CYUSB3314-88LTXC
*#3 = TitleBlock0: Page Create Date: March  8, 1995

## Nets that join several sheets
DVDD12: Power (C255.1 L25.2 U23.4), Cyusb3314_Power (33 pins)
GND: Cyusb3314_Indicator (7 pins), Power (12 pins), Cyusb3314_Interface (43 pins), Cyusb3314_Power (54 pins)
V3p3: Cyusb3314_Indicator (8 pins), Power (6 pins), Cyusb3314_Interface (8 pins), Cyusb3314_Power (7 pins)
VCC(+5V): Power (6 pins), Cyusb3314_Interface (DPR1.3 DPR2.1 J24.2)
NetC188_1: Cyusb3314_Indicator (J11.10), Cyusb3314_Interface (C188.1 R121.1 SW10.2 U13.37)
NetJ11_4: Cyusb3314_Indicator (J11.4), Cyusb3314_Interface (R116.2 U13.27)